# EAGLE design PowerDistributionBoard (EAGLE 8.2.0)
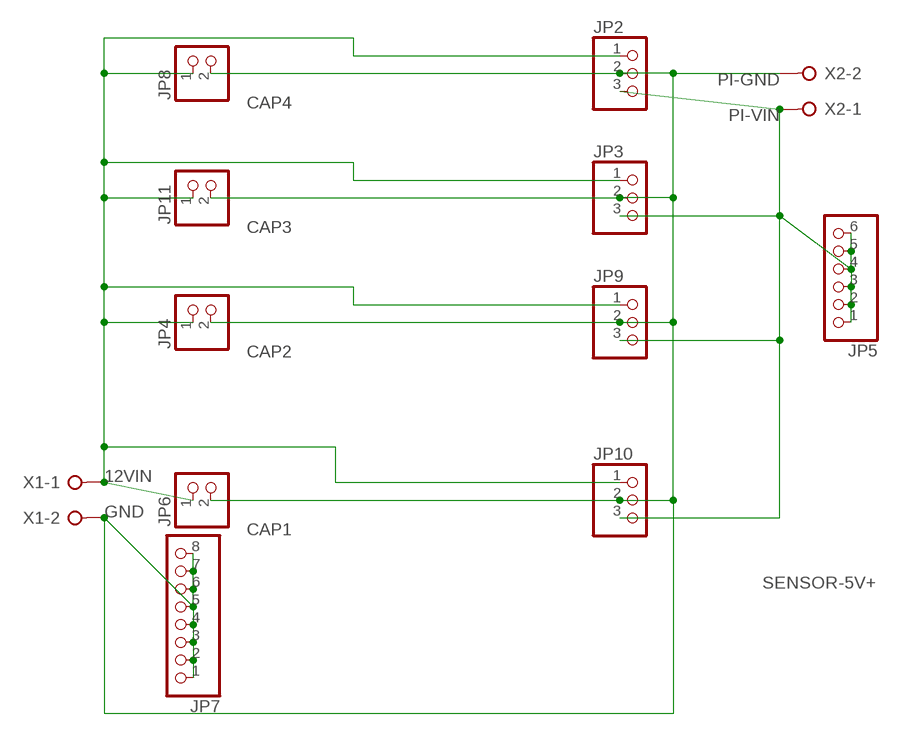
[diagram p0: schematic, sheet 1]

## Parts
JP2  PINHD-1X3  [1X03]
JP3  PINHD-1X3  [1X03]
JP4  PINHD-1X2  [1X02]
JP5  PINHD-1X6  [1X06]
JP6  PINHD-1X2  [1X02]
JP7  PINHD-1X8  [1X08]
JP8  PINHD-1X2  [1X02]
JP9  PINHD-1X3  [1X03]
JP10  PINHD-1X3  [1X03]
JP11  PINHD-1X2  [1X02]
X1  W237-02P  [W237-132]
X2  W237-02P  [W237-132]

## Nets
COMMON-GND: JP2.2 JP3.2 JP4.2 JP6.2 JP7.1 JP7.2 JP7.3 JP7.4 JP7.5 JP7.6 JP7.7 JP7.8 JP8.2 JP9.2 JP10.2 JP11.2 X1.2 X2.2
N$1: JP2.1 JP3.1 JP4.1 JP6.1 JP8.1 JP9.1 JP10.1 JP11.1 X1.1
SENSOR-5V+: JP2.3 JP3.3 JP5.1 JP5.2 JP5.3 JP5.4 JP5.5 JP5.6 JP9.3 JP10.3 X2.1

## Library data of the parts
JP2 JP3 JP9 JP10 = pinhead:PINHD-1X3: PIN HEADER
JP4 JP6 JP8 JP11 = pinhead:PINHD-1X2: PIN HEADER
JP5 = pinhead:PINHD-1X6: PIN HEADER
JP7 = pinhead:PINHD-1X8: PIN HEADER
X1 X2 = con-wago-508:W237-02P: WAGO SREW CLAMP; OC_FARNELL: unknown; OC_NEWARK: unknown

## Board
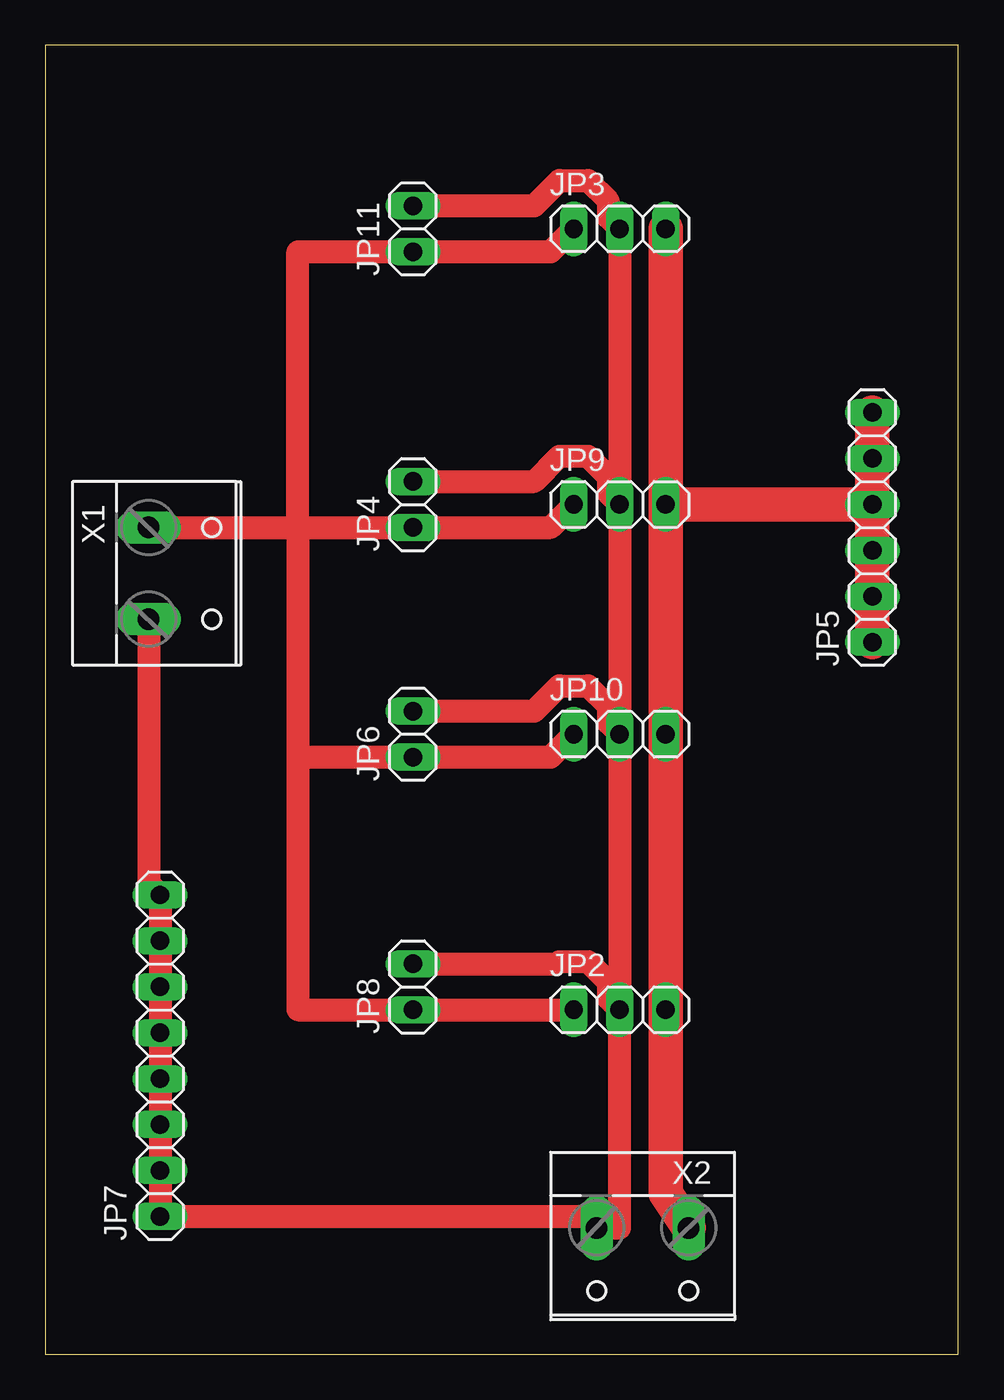
[diagram p1: board, top side]

Size 50.47 x 72.38 mm. Coordinates in mm from the lower left corner, seen from the top.
Outline: 0,0 50.47,0 50.47,72.38 0,72.38 0,0
Copper layers (1*16): Top 0.035mm / dielectric 1.5mm / Bottom 0.035mm
Design rules "default *": minimum track width 44mil, minimum drill 20mil, track to track 20mil, track to pad 20mil, pad to pad 20mil, via to via 20mil, smd to smd 0mil, copper to edge 40mil, drill to drill 6mil, minimum pad ring 10mil, minimum via ring 8mil, stop-mask expansion 4mil, vias tented up to drill 0mil, thermal gap 10mil

### Footprints (pad centres in the part's own frame; a part is rotated, then mirrored left to right if it is on the bottom)
1X03 = drill 1.016 long: 1 -2.54,0; 2 0,0; 3 2.54,0
1X02 = drill 1.016 long: 1 -1.27,0; 2 1.27,0
1X06 = drill 1.016 long: 1 -6.35,0; 2 -3.81,0; 3 -1.27,0; 4 1.27,0; 5 3.81,0; 6 6.35,0
1X08 = drill 1.016 long: 1 -8.89,0; 2 -6.35,0; 3 -3.81,0; 4 -1.27,0; 5 1.27,0; 6 3.81,0; 7 6.35,0; 8 8.89,0
W237-132 = drill 1.194 long: 1 -2.54,-0.635; 2 2.54,-0.635

### Placement (x,y rotation side)
JP2  31.75,19.05 0 top
JP3  31.75,62.23 0 top
JP4  20.32,46.99 90 top
JP5  45.72,45.72 90 top
JP6  20.32,34.29 90 top
JP7  6.35,16.51 90 top
JP8  20.32,20.32 90 top
JP9  31.75,46.99 0 top
JP10  31.75,34.29 0 top
JP11  20.32,62.23 90 top
X1  6.35,43.18 270 top
X2  33.02,6.35 180 top

### Tracks (layer width: path | path; a pad name or v marks a point on that pad's centre or on a via)
COMMON-GND
  Top 1.27: JP11.2 27.02,63.5 28.42,64.9 30,64.9 31.11,63.78 31.11,62.87 JP3.2 JP9.2 | X1.2 5.71,26.03 JP7.8 JP7.7 JP7.6 JP7.5 JP7.4 JP7.3 JP7.2 JP7.1 30.48,7.62 X2.2 31.75,6.99 JP2.2 | JP9.2 31.11,47.62 31.11,48.54 30,49.66 28.42,49.66 27.02,48.26 JP4.2 | JP10.2 31.11,34.92 31.11,35.84 30,36.96 28.42,36.96 27.02,35.56 JP6.2 | JP8.2 28.29,21.59 28.42,21.72 30,21.72 31.11,20.6 31.11,19.69 JP2.2 | JP9.2 JP10.2 | JP10.2 JP2.2
N$1
  Top 1.27: JP3.1 27.94,60.96 JP11.1 13.97,60.96 13.97,45.72 | X1.1 13.97,45.72 | 13.97,45.72 JP4.1 27.94,45.72 JP9.1 | 13.97,45.72 13.97,33.02 | 13.97,33.02 13.97,19.05 JP8.1 JP2.1 | 13.97,33.02 JP6.1 27.94,33.02 JP10.1
SENSOR-5V+
  Top 1.905: JP3.3 JP9.3 | JP9.3 JP10.3 JP2.3 34.29,8.89 X2.1 | JP9.3 JP5.4 | JP5.6 JP5.5 JP5.4 | JP5.4 JP5.3 JP5.2 JP5.1